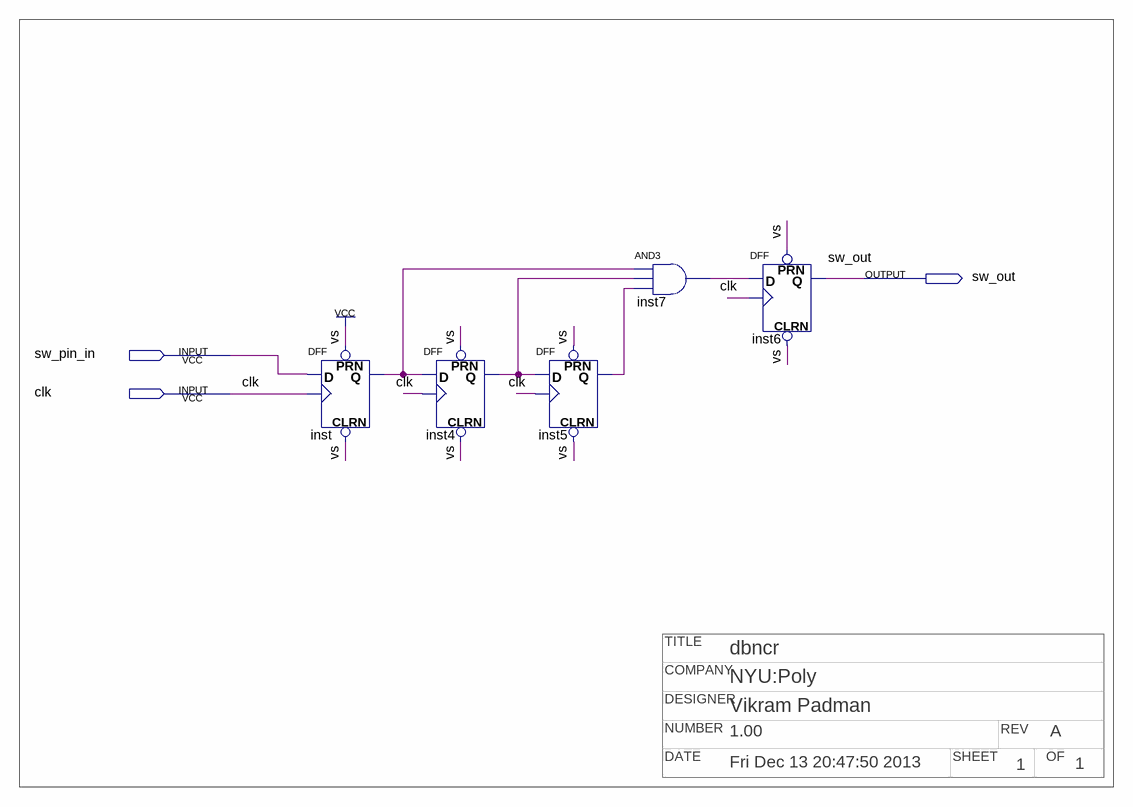
[diagram p0: schematic sheet]
// Quartus schematic dbncr.bdf as structural Verilog: 5 symbols, 3 pins
// Title block: COMPANY: NYU:Poly; DATE: Fri Dec 13 20:47:50 2013; DESIGNER: Vikram Padman; NUMBER: 1.00; OF: 1; REV: A; SHEET: 1; TITLE: dbncr
module dbncr (
  input  sw_pin_in,
  input  clk,
  output sw_out
);

  wire inst4_q, inst5_q, inst7_out, inst_q;

  DFF inst (.CLRN(1'b1), .CLK(clk), .D(sw_pin_in), .PRN(1'b1), .Q(inst_q));
  DFF inst4 (.CLRN(1'b1), .CLK(clk), .D(inst_q), .PRN(1'b1), .Q(inst4_q));
  DFF inst5 (.CLRN(1'b1), .CLK(clk), .D(inst4_q), .PRN(1'b1), .Q(inst5_q));
  and inst7 (inst7_out, inst_q, inst4_q, inst5_q);
  DFF inst6 (.CLRN(1'b1), .CLK(clk), .D(inst7_out), .PRN(1'b1), .Q(sw_out));
endmodule
